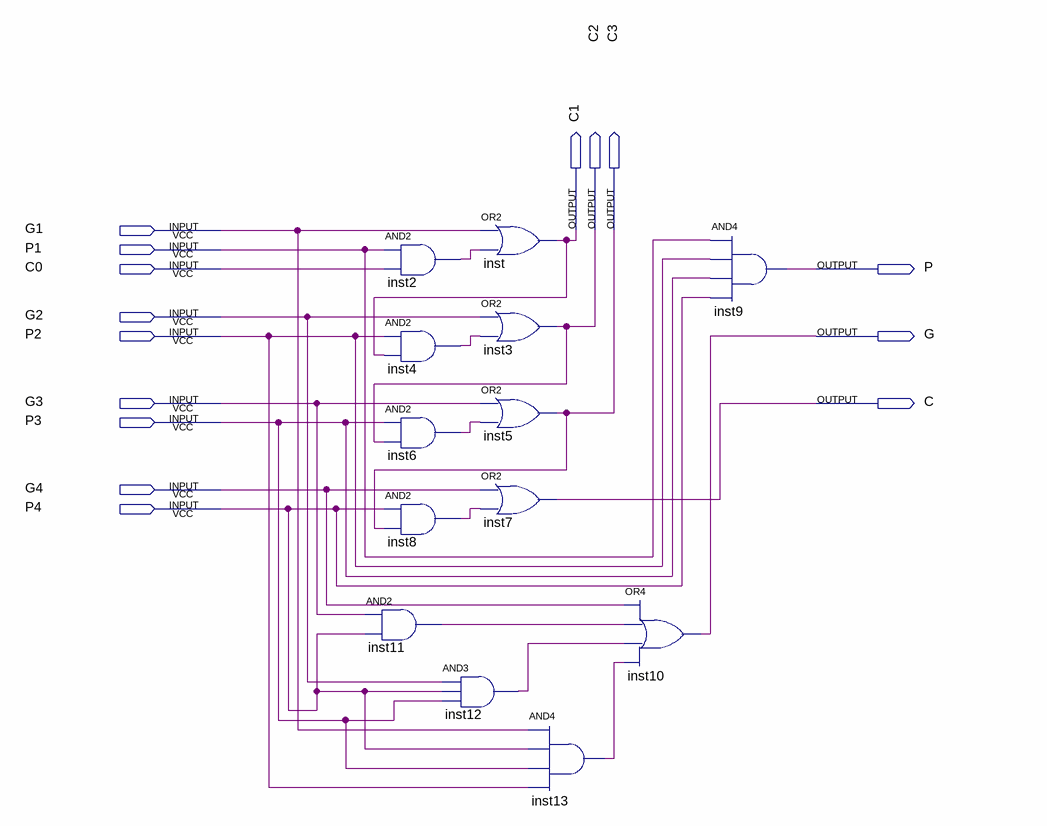
[diagram p0: schematic sheet]
// Quartus schematic carryLookaheadLogic.bdf as structural Verilog: 13 symbols, 15 pins
module carryLookaheadLogic (
  input  G1,
  input  P1,
  input  C0,
  input  G2,
  input  P2,
  input  G3,
  input  P3,
  input  G4,
  input  P4,
  output C1,
  output C2,
  output C3,
  output P,
  output G,
  output C
);

  wire inst2_out, inst4_out, inst6_out, inst8_out, inst11_out, inst12_out, inst13_out;

  and inst2 (inst2_out, P1, C0);
  and inst4 (inst4_out, P2, C1);
  and inst6 (inst6_out, P3, C2);
  and inst8 (inst8_out, P4, C3);
  and inst11 (inst11_out, G3, P4);
  or inst (C1, G1, inst2_out);
  or inst3 (C2, G2, inst4_out);
  or inst5 (C3, G3, inst6_out);
  or inst7 (C, G4, inst8_out);
  and inst12 (inst12_out, G2, P4, P3);
  and inst13 (inst13_out, G1, P4, P3, P2);
  or inst10 (G, G4, inst11_out, inst12_out, inst13_out);
  and inst9 (P, P1, P2, P3, P4);
endmodule
